# Altium schematic sheet [7]3-axis-accelerometer.SchDoc
size B
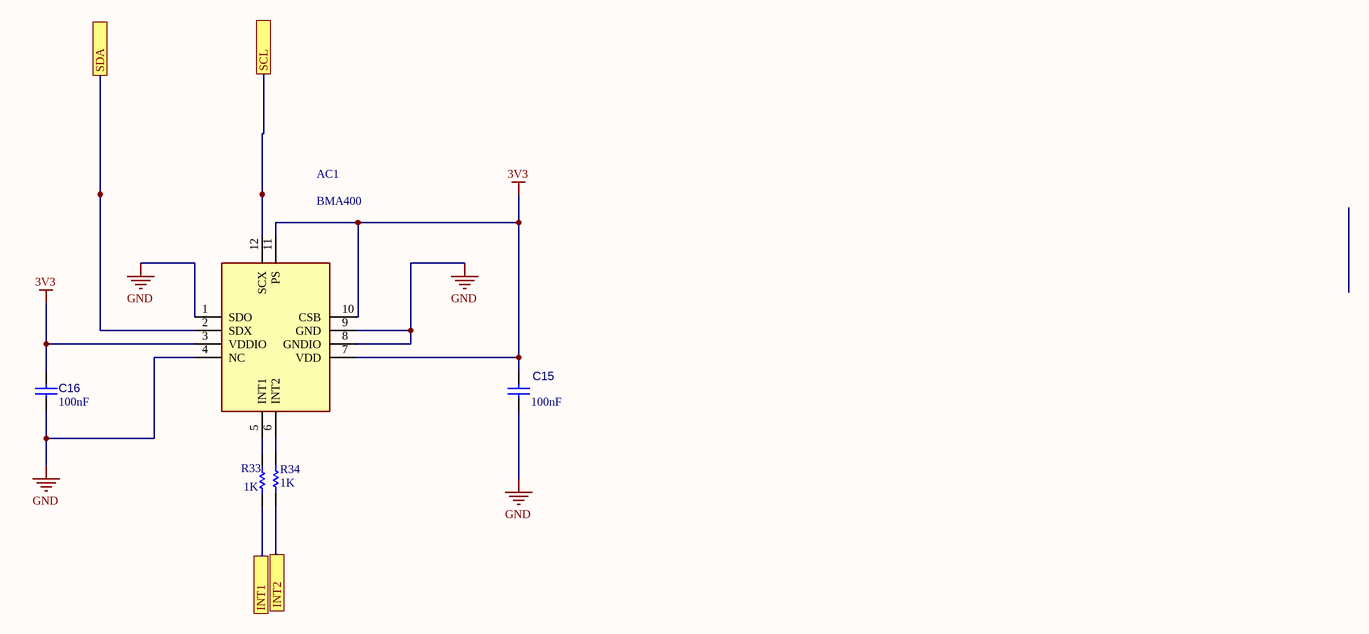
[diagram p0: [7]3-axis-accelerometer.SchDoc]

## Parts
AC1  BMA400  [BMA280]
C15  value 100nF  [CAPC1608X90X40ML10T20]  (hidden comment: Capacitor 100 nF +/-10% 50 V 0603)
C16  value 100nF  [CAPC1608X90X40ML10T20]  (hidden comment: Capacitor 100 nF +/-10% 50 V 0603)
R33  1K  [RES 0603]
R34  1K  [RES 0603]

## Ports
INT1, INT2, SCL, SDA

## Nets
3V3: AC1.3(VDDIO) AC1.7(VDD) AC1.10(CSB) AC1.11(PS) C15.2 C16.2
GND: AC1.1(SDO) AC1.4(NC) AC1.8(GNDIO) AC1.9(GND) C15.1 C16.1
INT1: R33.2 ; port INT1
INT2: R34.2 ; port INT2
SCL: AC1.12(SCX) ; port SCL
SDA: AC1.2(SDX) ; port SDA
NetAC1_5: AC1.5(INT1) R33.1
NetAC1_6: AC1.6(INT2) R34.1

## Library data of the parts
AC1 = BMA280: Accelerometer; Manufacturer_Name: Bosch Sensortec; Datasheet Link: https://ae-bst.resource.bosch.com/media/_tech/media/datasheets/BST-BMA280-DS000.pdf; Height: 1mm; Manufacturer_Part_Number: BMA280; Arrow Part Number: BMA280; Arrow Price/Stock: https://www.arrow.com/en/products/bma280/bosch; Mouser Part Number: 262-BMA280; Mouser Price/Stock: https://www.mouser.co.uk/ProductDetail/Bosch-Sensortec/BMA280?qs=d72FGnIDsgRcX8VH3KFYOw%3D%3D; ComponentLink1Description: docu; ComponentLink1URL: https://www.bosch-sensortec.com/media/boschsensortec/downloads/datasheets/bst-bma280-ds000.pdf
C15 C16 = CMP-001-00017-4: Chip Capacitor, 100 nF, +/- 10%, 50 V, 0603 (1608 Metric); Capacitor Type: Ceramic; Voltage Rating: 50V; RoHS Compliant: True; Max Operating Temperature: 125°C; Pins: 2; Mounting Technology: SM; Min Operating Temperature: -55°C; Tolerance: 10%; Case/Package: 0603
R33 R34 = RES 3.3M 1% 0.1W [0603]: 1K 1% 0.1W [0603]; Value: 1M; Supplier 1: Digi-Key; Supplier Part Number 1: 541-3.30MHCT-ND; Tolerance: 1%